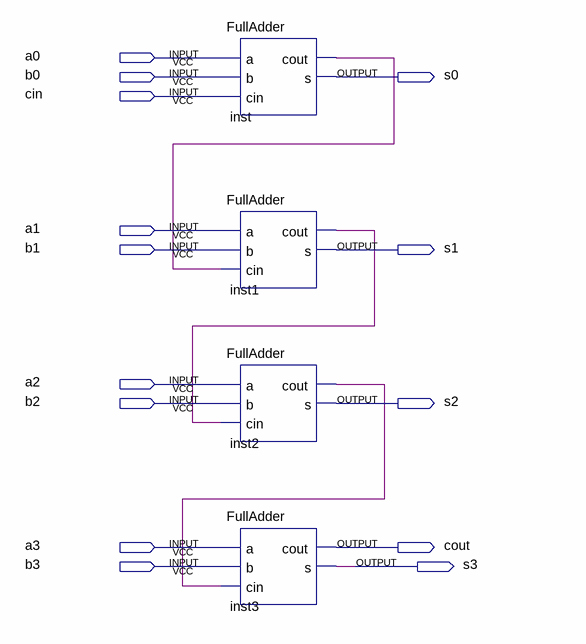
[diagram p0: schematic sheet]
// Quartus schematic AddSub4.bdf as structural Verilog: 4 symbols, 14 pins
module AddSub4 (
  input  a0,
  input  b0,
  input  cin,
  input  a1,
  input  b1,
  input  a2,
  input  b2,
  input  a3,
  input  b3,
  output s0,
  output s1,
  output s2,
  output cout,
  output s3
);

  wire inst1_cout, inst2_cout, inst_cout;

  FullAdder inst (.a(a0), .b(b0), .cin(cin), .cout(inst_cout), .s(s0));
  FullAdder inst1 (.a(a1), .b(b1), .cin(inst_cout), .cout(inst1_cout), .s(s1));
  FullAdder inst2 (.a(a2), .b(b2), .cin(inst1_cout), .cout(inst2_cout), .s(s2));
  FullAdder inst3 (.a(a3), .b(b3), .cin(inst2_cout), .cout(cout), .s(s3));
endmodule
